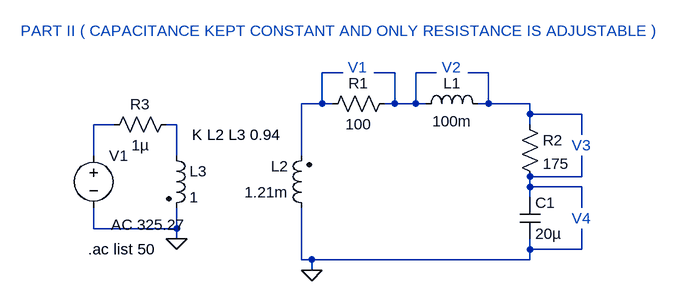
[diagram p0: schematic EXP1_PART1_CIRCUITO2.asc]
EXP1_PART1_CIRCUITO2.asc, the LTspice schematic file:
Version 4
SHEET 1 880 680
WIRE 96 64 64 64
WIRE 176 64 144 64
WIRE 240 64 208 64
WIRE 320 64 288 64
WIRE 64 112 64 64
WIRE 64 112 32 112
WIRE 80 112 64 112
WIRE 176 112 176 64
WIRE 176 112 160 112
WIRE 208 112 208 64
WIRE 208 112 176 112
WIRE 224 112 208 112
WIRE 320 112 320 64
WIRE 320 112 304 112
WIRE 384 112 320 112
WIRE 384 128 384 112
WIRE 464 128 384 128
WIRE -256 144 -288 144
WIRE -160 144 -176 144
WIRE 384 144 384 128
WIRE 464 160 464 128
WIRE -288 192 -288 144
WIRE -160 192 -160 144
WIRE 32 192 32 112
WIRE 464 224 464 192
WIRE 464 224 384 224
WIRE 384 240 384 224
WIRE 464 240 384 240
WIRE 384 256 384 240
WIRE 464 272 464 240
WIRE -288 304 -288 272
WIRE -160 304 -160 272
WIRE -160 304 -288 304
WIRE -160 320 -160 304
WIRE 384 336 384 320
WIRE 464 336 464 304
WIRE 464 336 384 336
WIRE 32 352 32 272
WIRE 48 352 32 352
WIRE 384 352 384 336
WIRE 384 352 48 352
WIRE 48 368 48 352
FLAG -160 320 0
FLAG 48 368 0
SYMBOL res 176 96 R90
WINDOW 0 0 56 VBottom 2
WINDOW 3 32 56 VTop 2
SYMATTR InstName R1
SYMATTR Value 100
SYMBOL ind 208 128 R270
WINDOW 0 32 56 VTop 2
WINDOW 3 5 56 VBottom 2
SYMATTR InstName L1
SYMATTR Value 100m
SYMBOL res 368 128 R0
SYMATTR InstName R2
SYMATTR Value 175
SYMBOL cap 368 256 R0
SYMATTR InstName C1
SYMATTR Value 20µ
SYMBOL ind2 48 288 R180
WINDOW 0 36 80 Left 2
WINDOW 3 36 40 Left 2
SYMATTR InstName L2
SYMATTR Value 1.21m
SYMATTR Type ind
SYMBOL ind2 -176 176 R0
SYMATTR InstName L3
SYMATTR Value 1
SYMATTR Type ind
SYMBOL res -160 128 R90
WINDOW 0 0 56 VBottom 2
WINDOW 3 32 56 VTop 2
SYMATTR InstName R3
SYMATTR Value 1µ
SYMBOL voltage -288 176 R0
WINDOW 123 84 138 Bottom 2
WINDOW 39 0 0 Left 0
SYMATTR Value2 AC 325.27
SYMATTR InstName V1
SYMATTR Value ""
TEXT -136 160 Left 2 !K L2 L3 0.94
TEXT -296 336 Left 2 !.ac list 50
TEXT 104 56 Left 2 ;V1
TEXT 248 56 Left 2 ;V2
TEXT 448 176 Left 2 ;V3
TEXT 448 288 Left 2 ;V4
TEXT -400 0 Left 2 ;PART II ( CAPACITANCE KEPT CONSTANT AND ONLY RESISTANCE IS ADJUSTABLE )

The netlist it stands for:
* EXP1_PART1_CIRCUITO2.asc
R1 N002 N001 100
L1 N002 N003 100m
R2 N003 N006 175
C1 N006 0 20µ
L2 0 N001 1.21m
L3 N005 0 1
R3 N005 N004 1µ
V1 N004 0 AC 325.27
K L2 L3 0.94
.ac list 50
* V1
* V2
* V3
* V4
* PART II ( CAPACITANCE KEPT CONSTANT AND ONLY RESISTANCE IS ADJUSTABLE )
.backanno
.end